# Altium schematic sheet Power_2.SchDoc
size A4; SheetNumber: 3; SheetTotal: 7
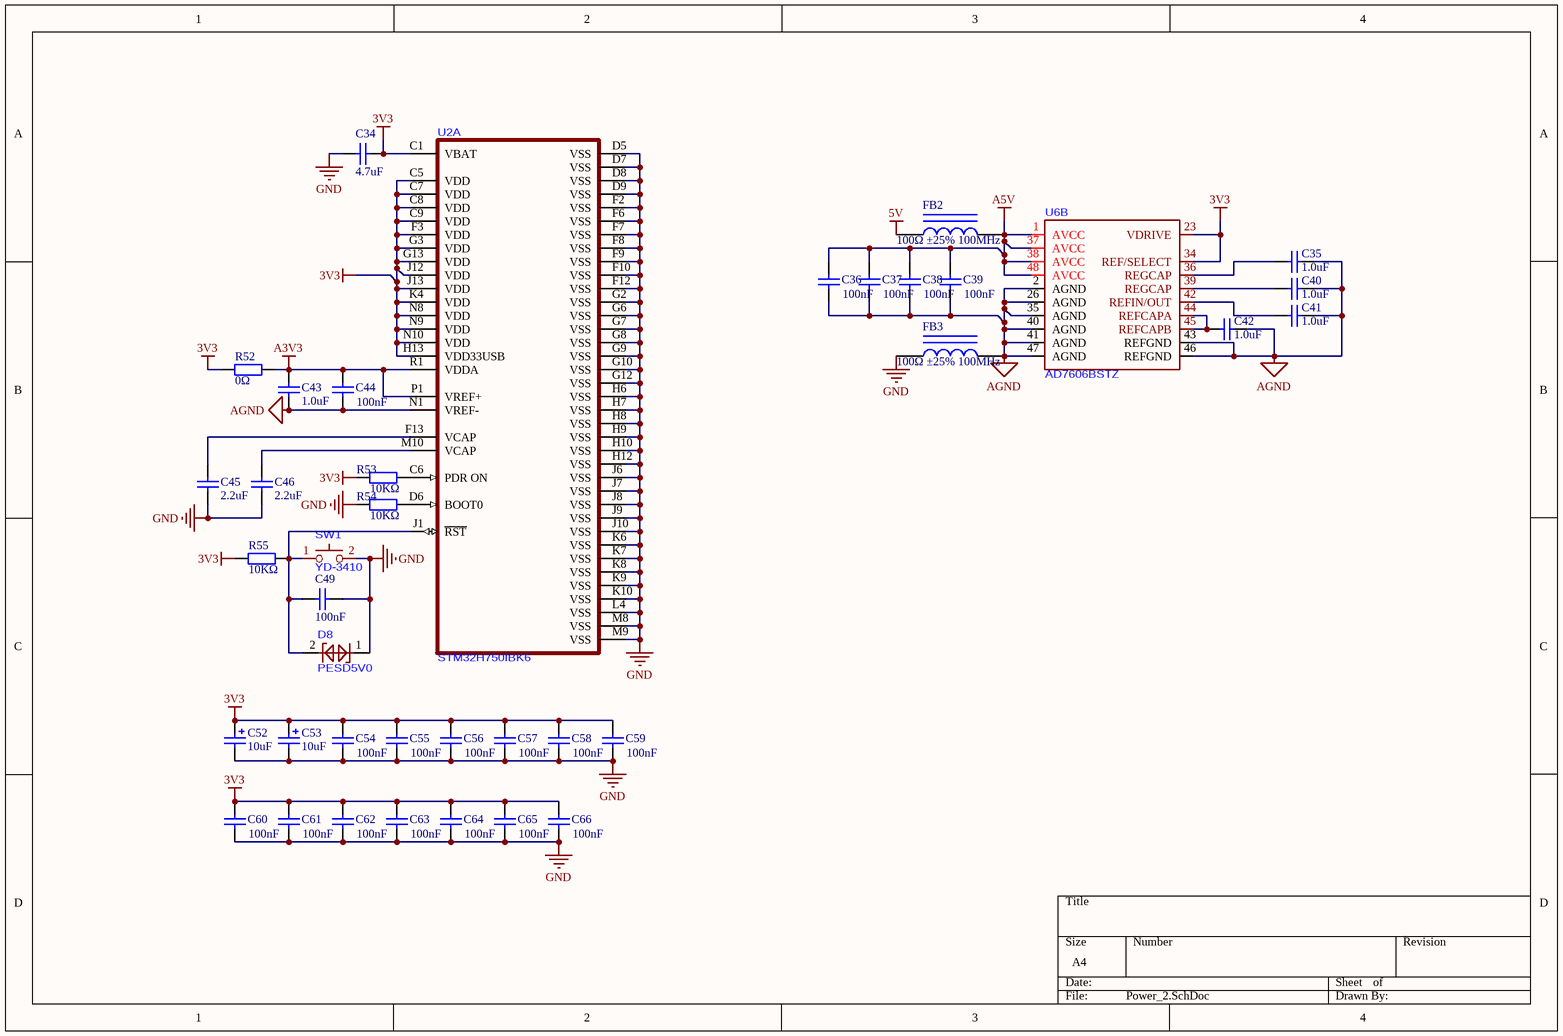
[diagram p0: Power_2.SchDoc]

## Parts
C34  4.7uF  [0402_C]
C35  1.0uF  [0402_C]
C36  100nF  [0402_C]
C37  100nF  [0402_C]
C38  100nF  [0402_C]
C39  100nF  [0402_C]
C40  1.0uF  [0402_C]
C41  1.0uF  [0402_C]
C42  1.0uF  [0402_C]
C43  1.0uF  [0402_C]
C44  100nF  [0402_C]
C45  2.2uF  [0402_C]
C46  2.2uF  [0402_C]
C49  100nF  [0402_C]
C52  10uF  [CASE-A_3216]
C53  10uF  [CASE-A_3216]
C54  100nF  [0402_C]
C55  100nF  [0402_C]
C56  100nF  [0402_C]
C57  100nF  [0402_C]
C58  100nF  [0402_C]
C59  100nF  [0402_C]
C60  100nF  [0402_C]
C61  100nF  [0402_C]
C62  100nF  [0402_C]
C63  100nF  [0402_C]
C64  100nF  [0402_C]
C65  100nF  [0402_C]
C66  100nF  [0402_C]
D8  PESD5V0  [SOD-882_L1.0-W0.6-BI]
FB2  100Ω ±25% 100MHz  [0805_L]
FB3  100Ω ±25% 100MHz  [0805_L]
R52  0Ω  [0402_R]
R53  10KΩ  [0402_R]
R54  10KΩ  [0402_R]
R55  10KΩ  [0402_R]
SW1  YD-3410  [SW-SMD_L3.9-W2.9-LS4.8-EH-A]
U2  STM32H750IBK6  [UFBGA176+25]  (part A of 3)
U6  AD7606BSTZ  [LQFP-64_L10.0-W10.0-P0.50-LS12.0-TL]  (part B of 2)

## Nets
3V3: C34.2 C52.1 C53.1 C54.2 C55.2 C56.2 C57.2 C58.2 C59.2 C60.2 C61.2 C62.2 C63.2 C64.2 C65.2 C66.2 R52.1 R53.2 R55.1 U2.C1(VBAT) U2.C5(VDD) U2.C7(VDD) U2.C8(VDD) U2.C9(VDD) U2.F3(VDD) U2.G3(VDD) U2.G13(VDD) U2.H13(VDD33USB) U2.J12(VDD) U2.J13(VDD) U2.K4(VDD) U2.N8(VDD) U2.N9(VDD) U2.N10(VDD) U6.23(VDRIVE) U6.34(REF/SELECT)
5V: FB2.1
A3V3: C43.2 C44.2 R52.2 U2.P1(VREF+) U2.R1(VDDA)
A5V: C36.2 C37.2 C38.2 C39.2 FB2.2 U6.1(AVCC) U6.37(AVCC) U6.38(AVCC) U6.48(AVCC)
AGND: C35.1 C36.1 C37.1 C38.1 C39.1 C40.1 C41.1 C42.1 C43.1 C44.1 FB3.2 U2.N1(VREF-) U6.2(AGND) U6.26(AGND) U6.35(AGND) U6.40(AGND) U6.41(AGND) U6.43(REFGND) U6.46(REFGND) U6.47(AGND)
GND: C34.1 C45.1 C46.1 C49.1 C52.2 C53.2 C54.1 C55.1 C56.1 C57.1 C58.1 C59.1 C60.1 C61.1 C62.1 C63.1 C64.1 C65.1 C66.1 D8.1 FB3.1 R54.2 SW1.2 U2.D5(VSS) U2.D7(VSS) U2.D8(VSS) U2.D9(VSS) U2.F2(VSS) U2.F6(VSS) U2.F7(VSS) U2.F8(VSS) U2.F9(VSS) U2.F10(VSS) U2.F12(VSS) U2.G2(VSS) U2.G6(VSS) U2.G7(VSS) U2.G8(VSS) U2.G9(VSS) U2.G10(VSS) U2.G12(VSS) U2.H6(VSS) U2.H7(VSS) U2.H8(VSS) U2.H9(VSS) U2.H10(VSS) U2.H12(VSS) U2.J6(VSS) U2.J7(VSS) U2.J8(VSS) U2.J9(VSS) U2.J10(VSS) U2.K6(VSS) U2.K7(VSS) U2.K8(VSS) U2.K9(VSS) U2.K10(VSS) U2.L4(VSS) U2.M8(VSS) U2.M9(VSS)
NetC35_2: C35.2 U6.36(REGCAP)
NetC40_2: C40.2 U6.39(REGCAP)
NetC41_2: C41.2 U6.42(REFIN/OUT)
NetC42_2: C42.2 U6.44(REFCAPA) U6.45(REFCAPB)
NetC45_2: C45.2 U2.F13(VCAP)
NetC46_2: C46.2 U2.M10(VCAP)
NetC49_2: C49.2 D8.2 R55.2 SW1.1 U2.J1(~{RST})
NetR53_1: R53.1 U2.C6(PDR_ON)
NetR54_1: R54.1 U2.D6(BOOT0)

## Library data of the parts
C34 = 0402 4.7uF (475) 20% 10V: 贴片电容; ComponentLink1Description: 供应商链接; ComponentLink1URL: http://www.szlcsc.com/product/details_24469.html; Package: 0402; Supplier: LC; SuppliersPartNumber: C23733
C35 C40-C43 C45 C46 = 0402 1.0uF (105) 10% 25V: 贴片电容; ComponentLink1Description: 供应商链接; ComponentLink1URL: http://www.szlcsc.com/product/details_53938.html; Package: 0402; Supplier: LC; SuppliersPartNumber: C52923
C36-C39 C44 C49 C54-C66 = 0402 100nF (104) 10% 16V: 贴片电容; ComponentLink1Description: 供应商链接; ComponentLink1URL: http://www.szlcsc.com/product/details_1877.html; Package: 0402; Supplier: LC; SuppliersPartNumber: C1525
C52 C53 = 3216 10uF (106) 10% 16V: 钽电容; ComponentLink1Description: 供应商链接; ComponentLink1URL: http://www.szlcsc.com/product/details_7643.html; Package: 3216; Supplier: LC; SuppliersPartNumber: C7171
D8 = PESD5V0F1BL,315
FB2 FB3 = 0805 100Ω 25% 100MHz: 贴片磁珠; ComponentLink1Description: 供应商链接; ComponentLink1URL: http://www.szlcsc.com/product/details_1367.html; Package: 0805; Supplier: LC; SuppliersPartNumber: C1015
R52 = 0402 0Ω (0R0) 1%: 贴片电阻; ComponentLink1Description: 供应商链接; ComponentLink1URL: http://www.szlcsc.com/product/details_17853.html; Package: 0402; Supplier: LC; SuppliersPartNumber: C17168
R53-R55 = 0402 10KΩ (1002) 1%: 贴片电阻; ComponentLink1Description: 供应商链接; ComponentLink1URL: http://www.szlcsc.com/product/details_26487.html; Package: 0402; Supplier: LC; SuppliersPartNumber: C25744